# EAGLE schematic filters_V1.1 (EAGLE 7.4.0)
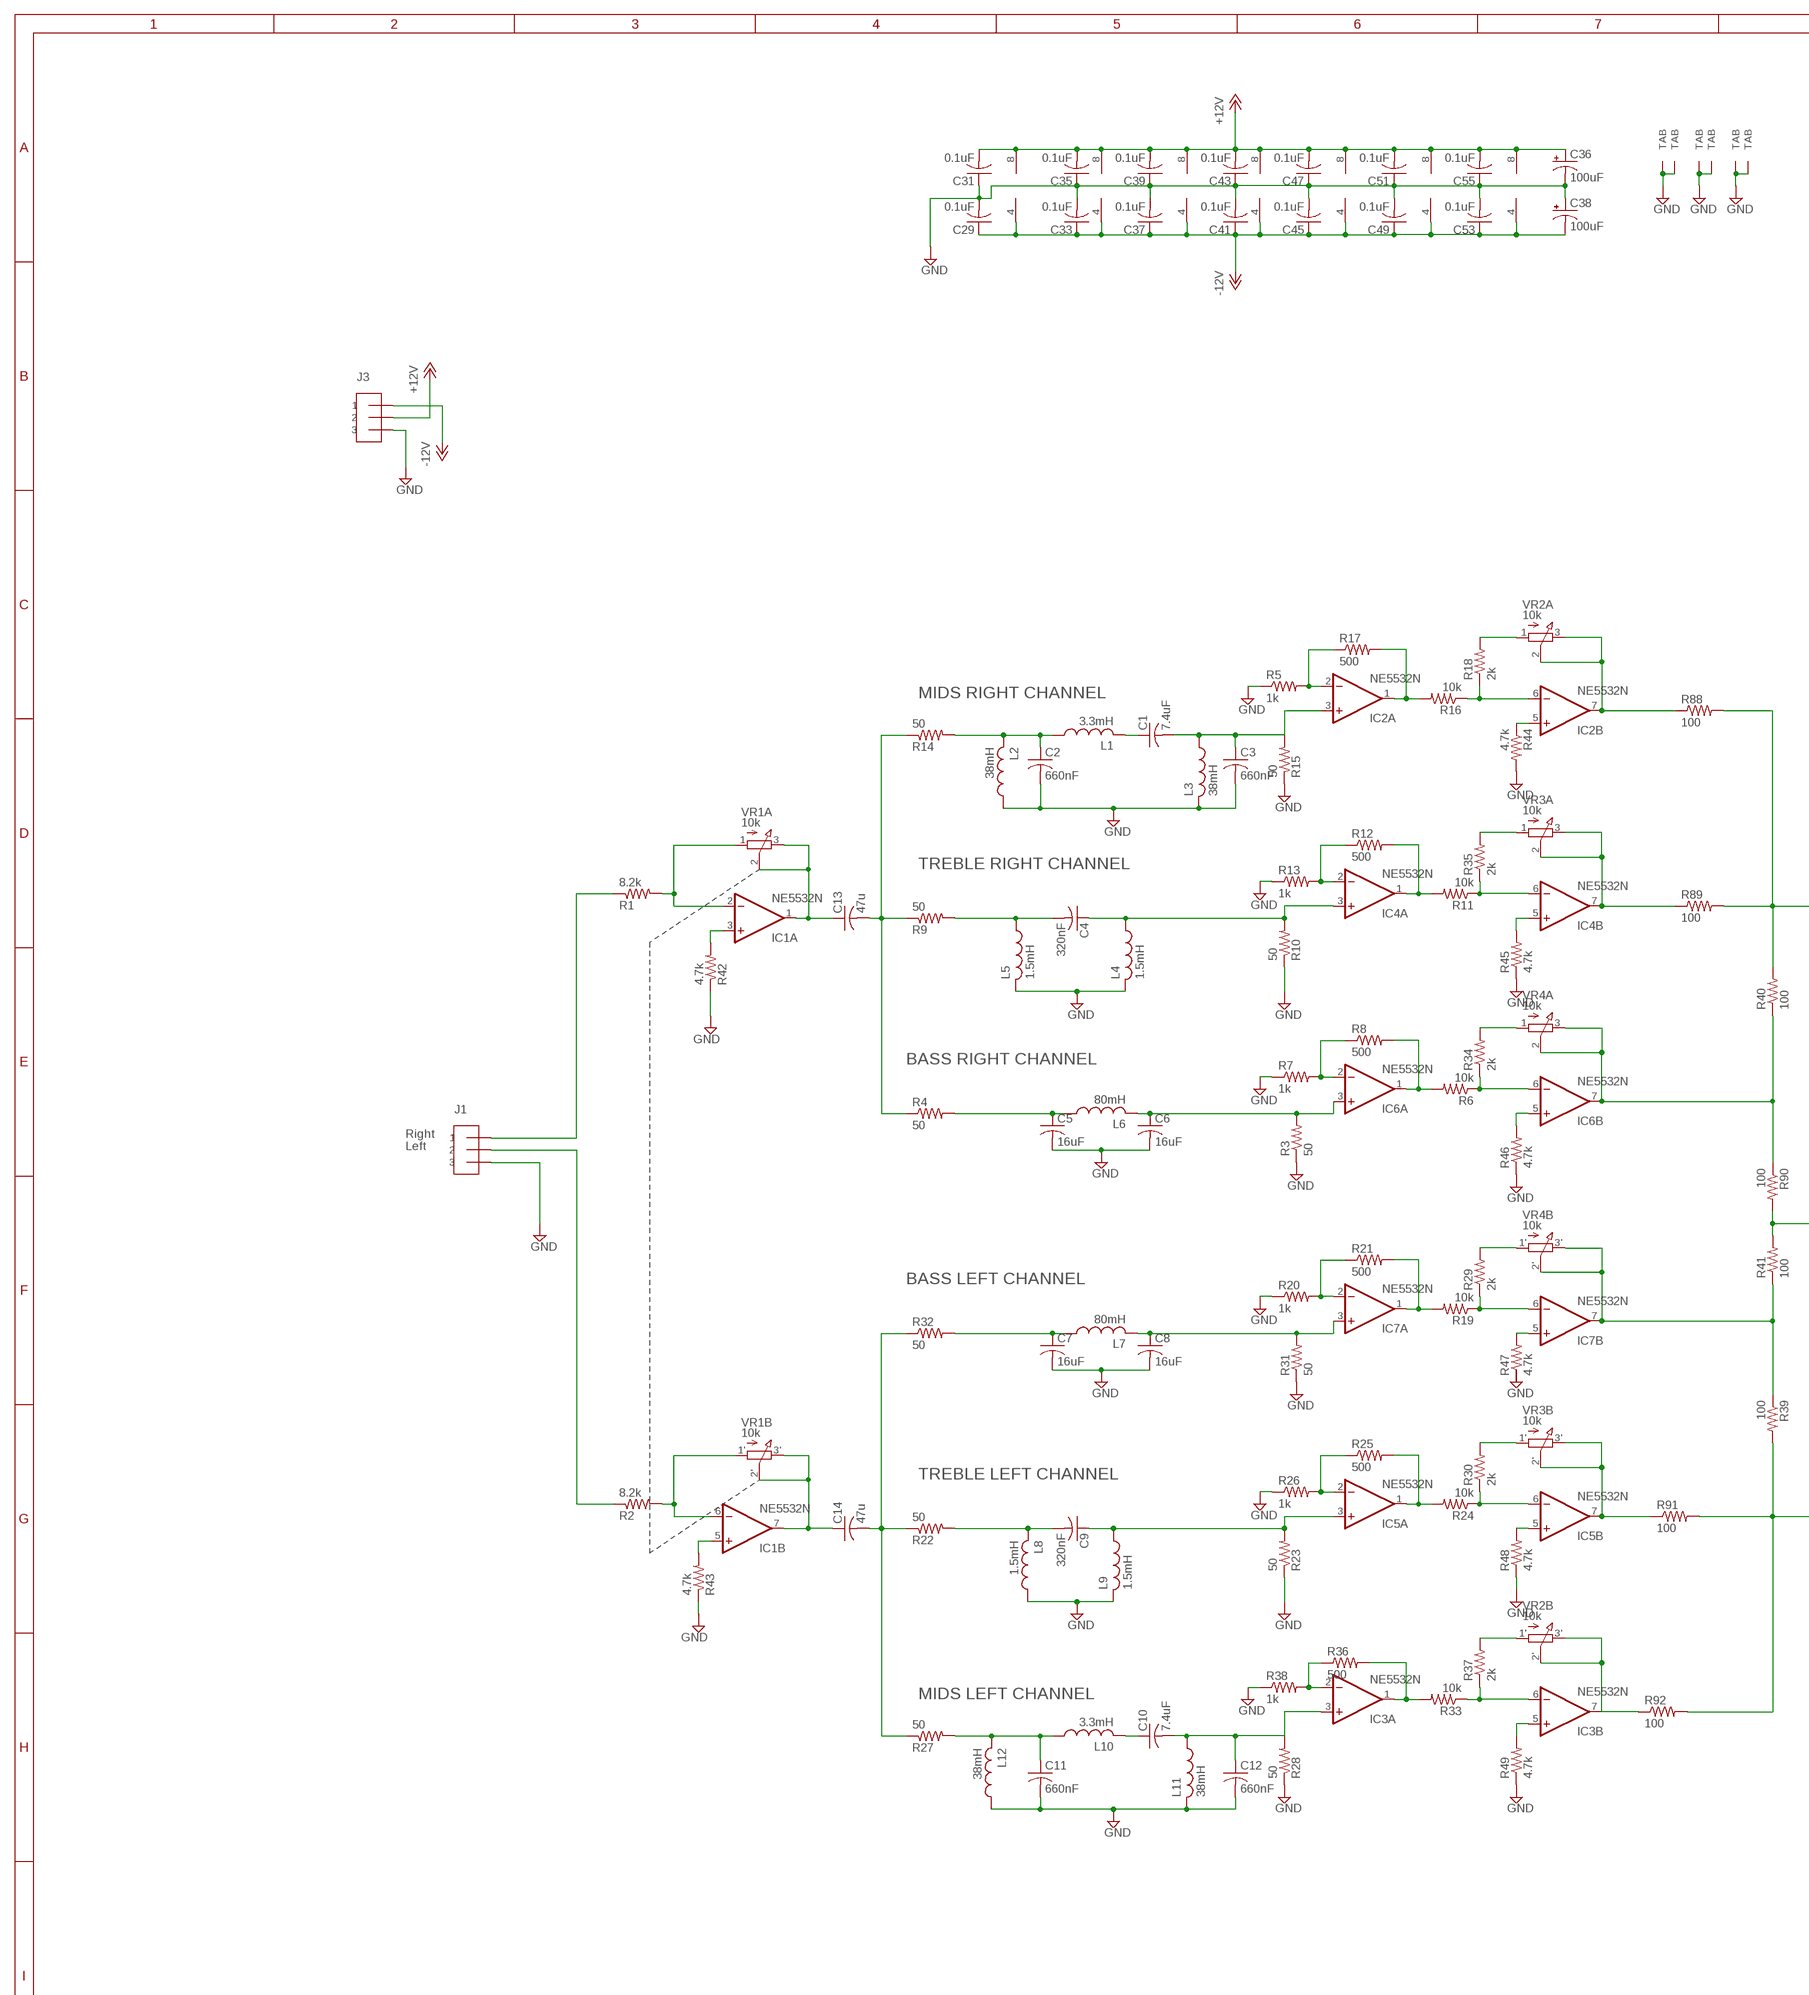
[diagram p0: schematic, sheet 1, part 1 of 2]
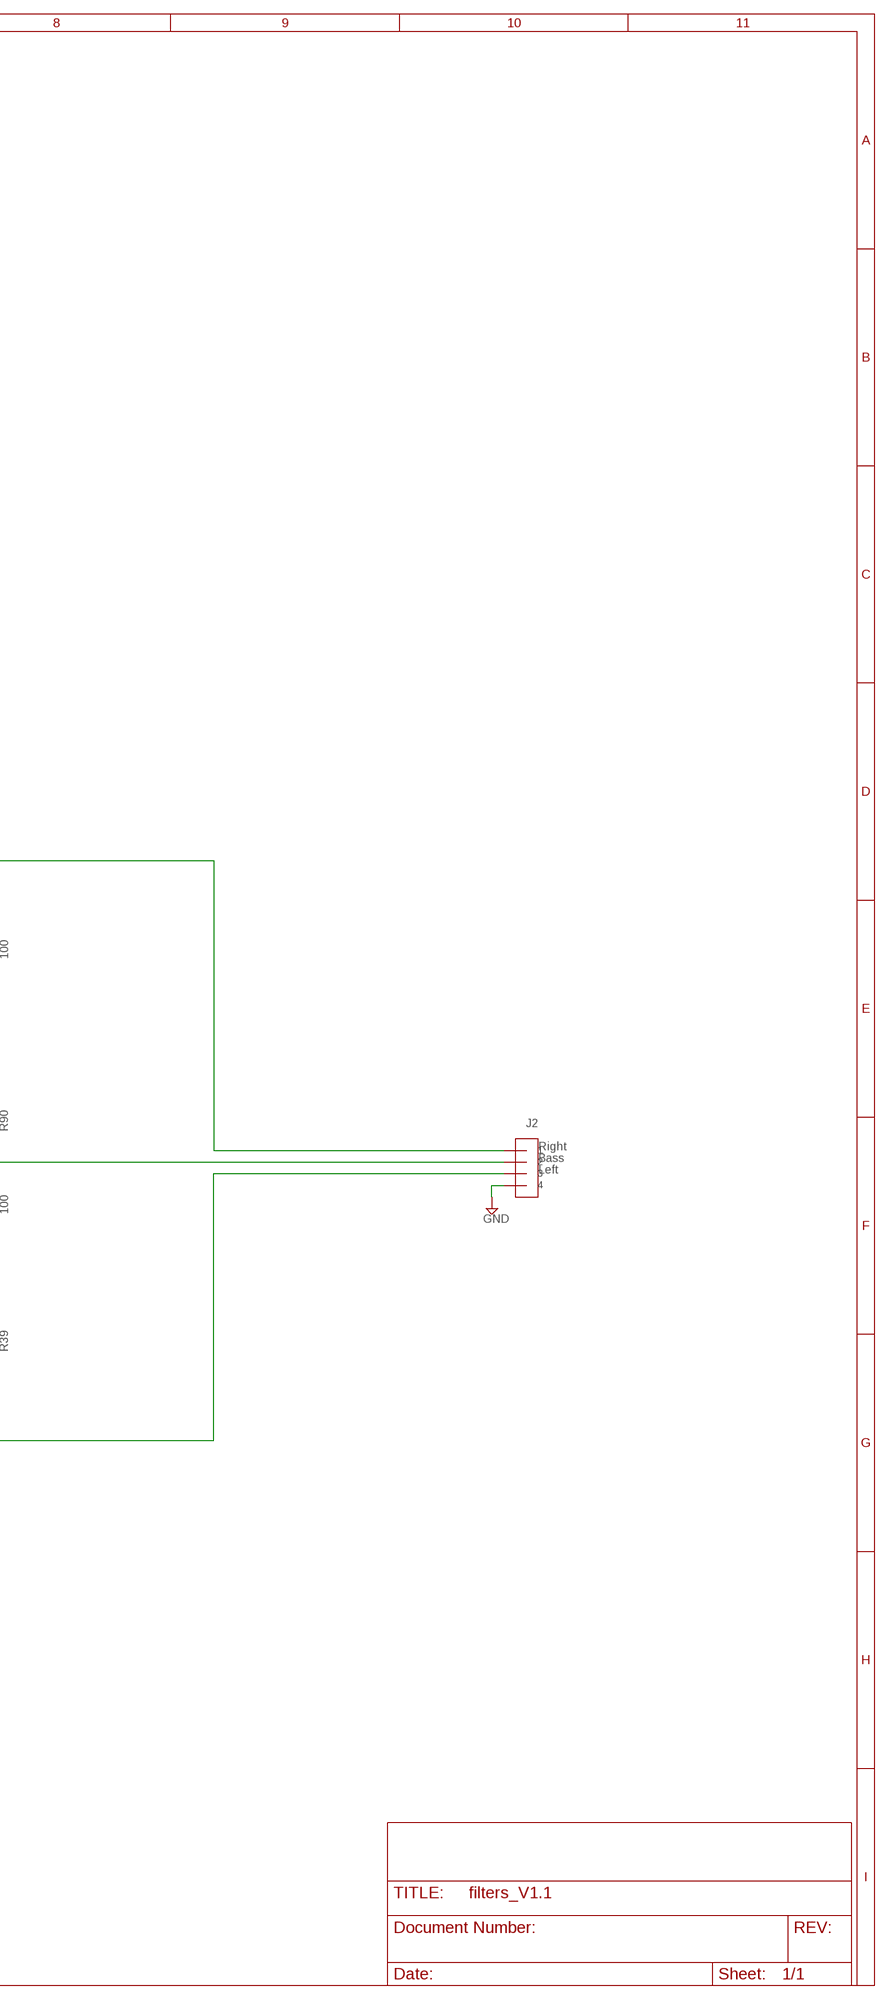
[diagram p1: schematic, sheet 1, part 2 of 2]

## Parts
C1  7.4uF  C-US050-024X044  [C050-024X044]
C2  660nF  C-US050-024X044  [C050-024X044]
C3  660nF  C-US050-024X044  [C050-024X044]
C4  320nF  C-US050-024X044  [C050-024X044]
C5  16uF  C-US050-024X044  [C050-024X044]
C6  16uF  C-US050-024X044  [C050-024X044]
C7  16uF  C-US050-024X044  [C050-024X044]
C8  16uF  C-US050-024X044  [C050-024X044]
C9  320nF  C-US050-024X044  [C050-024X044]
C10  7.4uF  C-US050-024X044  [C050-024X044]
C11  660nF  C-US050-024X044  [C050-024X044]
C12  660nF  C-US050-024X044  [C050-024X044]
C13  47u  C-US050-024X044  [C050-024X044]
C14  47u  C-US050-024X044  [C050-024X044]
C29  0.1uF  C-US050-024X044  [C050-024X044]
C31  0.1uF  C-US050-024X044  [C050-024X044]
C33  0.1uF  C-US050-024X044  [C050-024X044]
C35  0.1uF  C-US050-024X044  [C050-024X044]
C36  100uF  CPOL-USE2.5-6  [E2,5-6]
C37  0.1uF  C-US050-024X044  [C050-024X044]
C38  100uF  CPOL-USE2.5-6  [E2,5-6]
C39  0.1uF  C-US050-024X044  [C050-024X044]
C41  0.1uF  C-US050-024X044  [C050-024X044]
C43  0.1uF  C-US050-024X044  [C050-024X044]
C45  0.1uF  C-US050-024X044  [C050-024X044]
C47  0.1uF  C-US050-024X044  [C050-024X044]
C49  0.1uF  C-US050-024X044  [C050-024X044]
C51  0.1uF  C-US050-024X044  [C050-024X044]
C53  0.1uF  C-US050-024X044  [C050-024X044]
C55  0.1uF  C-US050-024X044  [C050-024X044]
IC1  NE5532N  [DIL08]
IC2  NE5532N  [DIL08]
IC3  NE5532N  [DIL08]
IC4  NE5532N  [DIL08]
IC5  NE5532N  [DIL08]
IC6  NE5532N  [DIL08]
IC7  NE5532N  [DIL08]
J1  3_PIN_AMPCONN  [3_PIN_AMPCONN]
J2  4_PIN_AMPCONN  [4_PIN_AMPCON]
J3  3_PIN_AMPCONN  [3_PIN_AMPCONN]
L1  3.3mH  L-US6000-XXX-RC  [6000-XXXX-RC]
L2  38mH  L-US6000-XXX-RC  [6000-XXXX-RC]
L3  38mH  L-US6000-XXX-RC  [6000-XXXX-RC]
L4  1.5mH  L-US6000-XXX-RC  [6000-XXXX-RC]
L5  1.5mH  L-US6000-XXX-RC  [6000-XXXX-RC]
L6  80mH  L-US6000-XXX-RC  [6000-XXXX-RC]
L7  80mH  L-US6000-XXX-RC  [6000-XXXX-RC]
L8  1.5mH  L-US6000-XXX-RC  [6000-XXXX-RC]
L9  1.5mH  L-US6000-XXX-RC  [6000-XXXX-RC]
L10  3.3mH  L-US6000-XXX-RC  [6000-XXXX-RC]
L11  38mH  L-US6000-XXX-RC  [6000-XXXX-RC]
L12  38mH  L-US6000-XXX-RC  [6000-XXXX-RC]
R1  8.2k  R-US_0204/2V  [0204V]
R2  8.2k  R-US_0204/2V  [0204V]
R3  50  R-US_0204/2V  [0204V]
R4  50  R-US_0204/2V  [0204V]
R5  1k  R-US_0204/2V  [0204V]
R6  10k  R-US_0204/2V  [0204V]
R7  1k  R-US_0204/2V  [0204V]
R8  500  R-US_0204/2V  [0204V]
R9  50  R-US_0204/2V  [0204V]
R10  50  R-US_0204/2V  [0204V]
R11  10k  R-US_0204/2V  [0204V]
R12  500  R-US_0204/2V  [0204V]
R13  1k  R-US_0204/2V  [0204V]
R14  50  R-US_0204/2V  [0204V]
R15  50  R-US_0204/2V  [0204V]
R16  10k  R-US_0204/2V  [0204V]
R17  500  R-US_0204/2V  [0204V]
R18  2k  R-US_0204/2V  [0204V]
R19  10k  R-US_0204/2V  [0204V]
R20  1k  R-US_0204/2V  [0204V]
R21  500  R-US_0204/2V  [0204V]
R22  50  R-US_0204/2V  [0204V]
R23  50  R-US_0204/2V  [0204V]
R24  10k  R-US_0204/2V  [0204V]
R25  500  R-US_0204/2V  [0204V]
R26  1k  R-US_0204/2V  [0204V]
R27  50  R-US_0204/2V  [0204V]
R28  50  R-US_0204/2V  [0204V]
R29  2k  R-US_0204/2V  [0204V]
R30  2k  R-US_0204/2V  [0204V]
R31  50  R-US_0204/2V  [0204V]
R32  50  R-US_0204/2V  [0204V]
R33  10k  R-US_0204/2V  [0204V]
R34  2k  R-US_0204/2V  [0204V]
R35  2k  R-US_0204/2V  [0204V]
R36  500  R-US_0204/2V  [0204V]
R37  2k  R-US_0204/2V  [0204V]
R38  1k  R-US_0204/2V  [0204V]
R39  100  R-US_0204/2V  [0204V]
R40  100  R-US_0204/2V  [0204V]
R41  100  R-US_0204/2V  [0204V]
R42  4.7k  R-US_0204/2V  [0204V]
R43  4.7k  R-US_0204/2V  [0204V]
R44  4.7k  R-US_0204/2V  [0204V]
R45  4.7k  R-US_0204/2V  [0204V]
R46  4.7k  R-US_0204/2V  [0204V]
R47  4.7k  R-US_0204/2V  [0204V]
R48  4.7k  R-US_0204/2V  [0204V]
R49  4.7k  R-US_0204/2V  [0204V]
R88  100  R-US_0204/2V  [0204V]
R89  100  R-US_0204/2V  [0204V]
R90  100  R-US_0204/2V  [0204V]
R91  100  R-US_0204/2V  [0204V]
R92  100  R-US_0204/2V  [0204V]
VR1  10k  VOL_POT_2GANG  [VOL_POT_2GANG]
VR2  10k  P140KV1-F25BR  [TONE_POT_2GANG]
VR3  10k  P140KV1-F25BR  [TONE_POT_2GANG]
VR4  10k  P140KV1-F25BR  [TONE_POT_2GANG]

## Nets
+12V: C31.2 C35.2 C36.+ C39.2 C43.2 C47.2 C51.2 C55.2 IC1.8(P:V+) IC2.8(P:V+) IC3.8(P:V+) IC4.8(P:V+) IC5.8(P:V+) IC6.8(P:V+) IC7.8(P:V+) J3.2
-12V: C29.1 C33.1 C37.1 C38.- C41.1 C45.1 C49.1 C53.1 IC1.4(P:V-) IC2.4(P:V-) IC3.4(P:V-) IC4.4(P:V-) IC5.4(P:V-) IC6.4(P:V-) IC7.4(P:V-) J3.1
GND: C2.2 C3.2 C5.2 C6.2 C7.2 C8.2 C11.2 C12.2 C29.2 C31.1 C33.2 C35.1 C36.- C37.2 C38.+ C39.1 C41.2 C43.1 C45.2 C47.1 C49.2 C51.1 C53.2 C55.1 J1.3 J2.4 J3.3 L2.1 L3.2 L4.2 L5.2 L8.1 L9.2 L11.2 L12.1 R3.1 R5.1 R7.1 R10.1 R13.1 R15.1 R20.1 R23.1 R26.1 R28.1 R31.1 R38.1 R42.1 R43.1 R44.2 R45.1 R46.1 R48.1 R49.1 VR2.P$3(TAB) VR2.P$4(TAB) VR3.P$3(TAB) VR3.P$4(TAB) VR4.P$3(TAB) VR4.P$4(TAB)
MVO: IC6.7(B:OUT) R40.1 R90.1 VR4.2(A:1_2) VR4.3(A:1_3)
N$1: IC1.2(A:-IN) R1.2 VR1.1
N$2: C13.1 IC1.1(A:OUT) VR1.2 VR1.3
N$3: IC1.6(B:-IN) R2.2 VR1.1'
N$4: IC2.6(B:-IN) R16.1 R18.1
N$5: C14.1 IC1.7(B:OUT) VR1.2' VR1.3'
N$6: IC6.2(A:-IN) R7.2 R8.1
N$7: C6.1 IC6.3(A:+IN) L6.2 R3.2
N$8: IC3.6(B:-IN) R33.1 R37.1
N$9: IC4.2(A:-IN) R12.1 R13.2
N$10: J2.1 R40.2 R88.2 R89.2
N$11: IC6.6(B:-IN) R6.1 R34.1
N$12: C5.1 L6.1 R4.2
N$13: C4.2 L5.1 R9.2
N$14: C8.1 IC7.3(A:+IN) L7.2 R31.2
N$15: IC2.1(A:OUT) R16.2 R17.2
N$16: IC1.3(A:+IN) R42.2
N$17: IC4.1(A:OUT) R11.2 R12.2
N$18: IC4.6(B:-IN) R11.1 R35.1
N$19: J2.2 R41.2 R90.2
N$20: IC1.5(B:+IN) R43.2
N$21: IC2.7(B:OUT) R88.1 VR2.2(A:1_2) VR2.3(A:1_3)
N$22: C13.2 R4.1 R9.1 R14.1
N$23: C2.1 L1.1 L2.2 R14.2
N$24: R18.2 VR2.1(A:1_1)
N$25: IC7.6(B:-IN) R19.1 R29.1
N$26: J1.1 R1.1
N$27: IC2.2(A:-IN) R5.2 R17.1
N$28: IC2.5(B:+IN) R44.1
N$29: C1.1 L1.2
N$30: C9.2 L8.2 R22.2
N$31: IC5.5(B:+IN) R48.2
N$32: IC5.1(A:OUT) R24.2 R25.2
N$33: IC5.6(B:-IN) R24.1 R30.1
N$34: C11.1 L10.1 L12.2 R27.2
N$35: C10.1 L10.2
N$36: IC4.5(B:+IN) R45.2
N$37: R29.2 VR4.1'(B:1_1)
N$38: J2.3 R39.2 R91.2 R92.2
N$39: IC6.5(B:+IN) R46.2
N$40: IC7.7(B:OUT) R39.1 R41.1 VR4.2'(B:1_2) VR4.3'(B:1_3)
N$41: IC5.7(B:OUT) R91.1 VR3.2'(B:1_2) VR3.3'(B:1_3)
N$42: R30.2 VR3.1'(B:1_1)
N$43: IC7.1(A:OUT) R19.2 R21.2
N$44: C7.1 L7.1 R32.2
N$45: IC7.2(A:-IN) R20.2 R21.1
N$46: IC5.2(A:-IN) R25.1 R26.2
N$47: IC3.1(A:OUT) R33.2 R36.2
N$48: IC3.5(B:+IN) R49.2
N$49: IC7.5(B:+IN) R47.2
N$50: IC3.7(B:OUT) R92.1 VR2.2'(B:1_2) VR2.3'(B:1_3)
N$53: R34.2 VR4.1(A:1_1)
N$55: IC4.7(B:OUT) R89.1 VR3.2(A:1_2) VR3.3(A:1_3)
N$56: R35.2 VR3.1(A:1_1)
N$57: R37.2 VR2.1'(B:1_1)
N$58: IC3.2(A:-IN) R36.1 R38.2
N$59: C10.2 C12.1 IC3.3(A:+IN) L11.1 R28.2
N$60: C14.2 R22.1 R27.1 R32.1
N$61: C9.1 IC5.3(A:+IN) L9.1 R23.2
N$63: C4.1 IC4.3(A:+IN) L4.1 R10.2
N$88: IC6.1(A:OUT) R6.2 R8.2
N$104: C1.2 C3.1 IC2.3(A:+IN) L3.1 R15.2
N$108: J1.2 R2.1
Unconnected: R47.1

## Notes on the sheet
- MIDS RIGHT CHANNEL
- TREBLE RIGHT CHANNEL
- BASS RIGHT CHANNEL
- Right
- Left
- Right
- Bass
- Left
- BASS LEFT CHANNEL
- TREBLE LEFT CHANNEL
- MIDS LEFT CHANNEL

## Library data of the parts
C1-C14 C29 C31 C33 C35 C37 C39 C41 C43 C45 C47 C49 C51 C53 C55 = rcl:C-US: CAPACITOR, American symbol
C36 C38 = rcl:CPOL-US: POLARIZED CAPACITOR, American symbol
IC1-IC7 = linear:NE5532: AUDIO AMPLIFIER
J1 J3 = Amplifier_Parts:3_PIN_AMPCONN
J2 = Amplifier_Parts:4_PIN_AMPCONN
L1-L12 = rcl:L-US: INDUCTOR, American symbol
R1-R49 R88-R92 = rcl:R-US_: RESISTOR, American symbol
VR1 = Amplifier_Parts:VOL_POT_2GANG
VR2-VR4 = Amplifier_Parts:P140KV1-F25BR